# EasyEDA Pro project Gripper Project File.epro

# Board PCB2_2
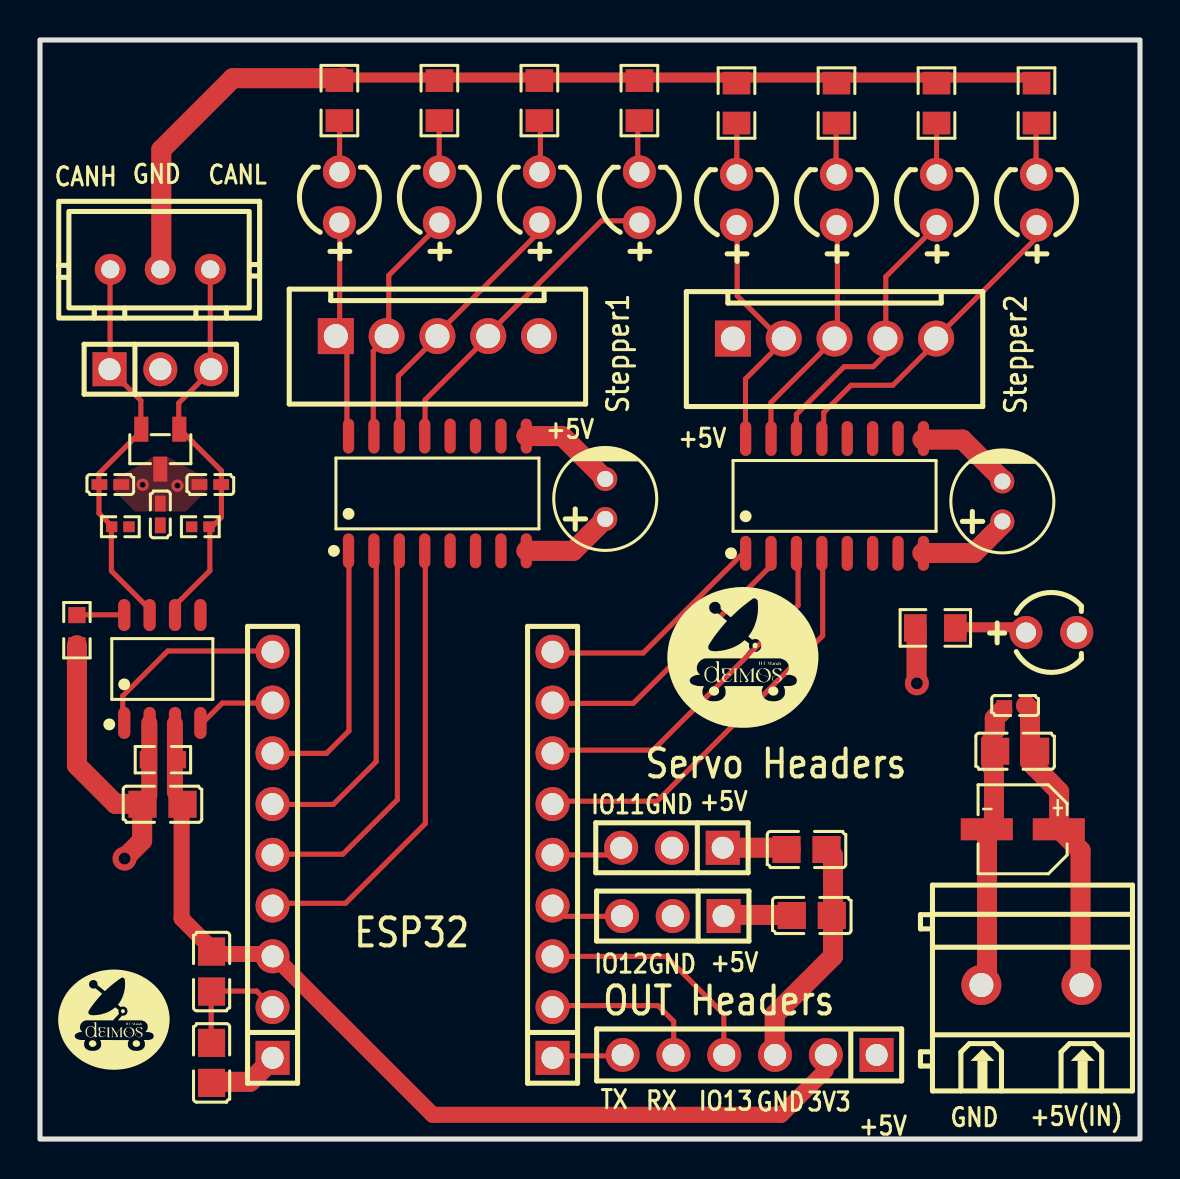
[diagram p0: board, top side]
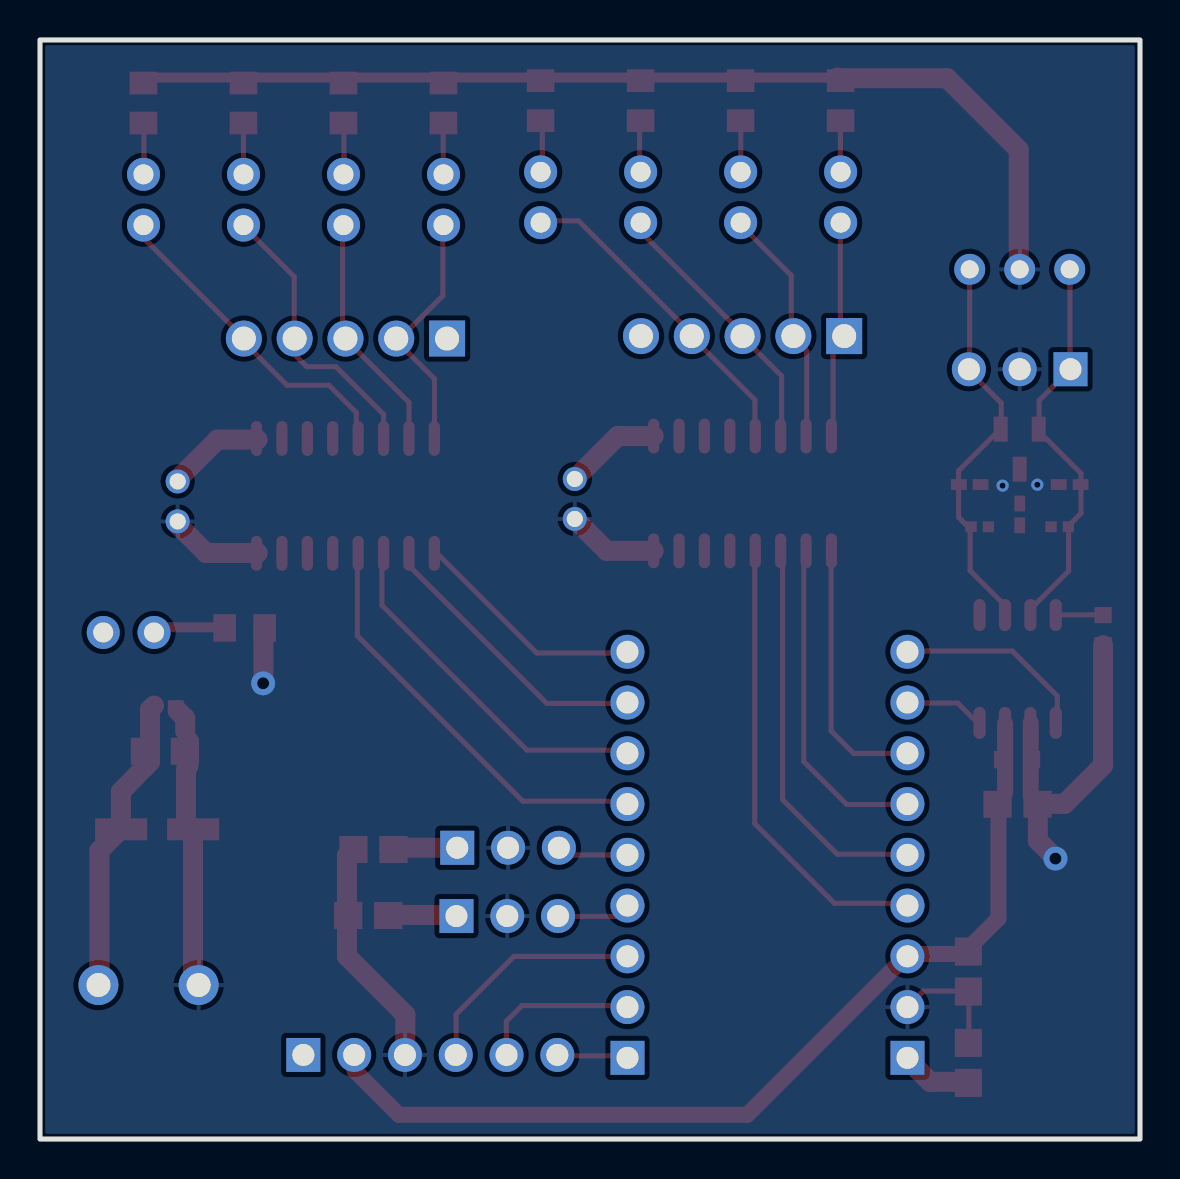
[diagram p1: board, bottom side, seen from below]

Outline 55 x 55 mm; copper layers: Top Layer, Inner1, Inner2, Bottom Layer. Coordinates in mm from the lower left corner of the outline.
Outline path: rectangle 0,55 55,0
Stack: Top Layer 0.035mm Outer layer thickness 1oz / Dielectric1 0.2104mm 7628 RC49% 8.6mil / Inner1 0.0152mm Inner layer thickness / Dielectric2 1.065mm 1.1mm H/HOZ Copper / Inner2 0.0152mm Inner layer thickness / Dielectric3 0.2104mm 7628 RC49% 8.6mil / Bottom Layer 0.035mm Outer layer thickness 1oz

## Design rules (mm)
template: Custom Config
spacing copperThickness1oz (default): track to track 0.102, other pairs 0.152 to 0.3
spacing copperThickness2oz: track to track 0.203, other pairs 0.152 to 0.3
track width copperThickness1oz (default): min 0.127, default 0.254, max 2.54
track width copperThickness2oz: min 0.203, default 0.254, max 2.54
differential pair differentialPair (default): width min 0.127, default 0.254, max 2.54; gap min 0.152, default 0.152
via viaSize (default): diameter min 0.5, default 0.61, max 10; hole min 0.3, default 0.305, max 6.3
net GND uses copperRegion1
net $1N8879 uses copperRegion1

## Placement (name value [footprint] x y rotation side)
C1  -  [C0402]  3.52 32.75 180 top
C2  4.7nF  [C0402]  6.02 31.26 270 top
C3  -  [C0402]  8.52 32.75 0 top
C4  10uF  [CAP-TH_BD5.0-P2.00-D0.6-FD]  28.26 32.03 90 top
C5  10uF  [CAP-TH_BD5.0-P2.00-D0.6-FD]  48.12 31.91 90 top
C6  CL21A226MQQNNNE  [C0805]  6.12 16.75 0 top
C7  CL05B104KP5NNNC  [R0603]  6.15 18.98 0 top
C8  1uF  [C0805]  48.76 19.41 0 top
C9  33nF  [C0402]  48.76 21.69 0 top
C10  1uF  [C0805]  38.33 14.49 0 top
C11  22uF  [CAP-SMD_BD4.0-L4.3-W4.3-LS5.1-FD]  49.14 15.5 180 top
C12  1uF  [C0805]  38.59 11.19 0 top
C13  1uF  [C0805]  8.58 8.38 90 top
C14  1uF  [C0805]  8.58 3.81 270 top
CN1  B5B-XH-A(LF)(SN)  [CONN-TH_B5B-XH-A-LF-SN]  19.87 40.18 180 top
CN2  B5B-XH-A(LF)(SN)  [CONN-TH_B5B-XH-A-LF-SN]  39.73 40.06 180 top
P1  Screw Terminal  [CONN-TH_2P-P5.00_WJ128V-5.0-2P]  49.57 7.71 0 top
R1  330Ω  [R0805]  14.97 51.97 90 top
R2  330Ω  [R0805]  19.97 51.97 90 top
R3  330Ω  [R0805]  24.97 51.97 90 top
R4  330Ω  [R0805]  29.97 51.97 90 top
R5  330Ω  [R0805]  34.83 51.84 90 top
R6  330Ω  [R0805]  39.83 51.84 90 top
R7  330Ω  [R0805]  44.83 51.84 90 top
R8  330Ω  [R0805]  49.83 51.84 90 top
R9  60.4kΩ  [R0402]  4.02 30.64 180 top
R10  60.4kΩ  [R0402]  8.02 30.64 0 top
R11  RC0603FR-1010KL  [R0603]  1.85 25.46 90 top
R12  330Ω  [R0805]  44.77 25.58 0 top
U1  LED  [LED-TH_BD4.0-P2.54-FD_RED]  14.97 47.13 90 top
U2  LED  [LED-TH_BD4.0-P2.54-FD_RED]  19.97 47.13 90 top
U3  LED  [LED-TH_BD4.0-P2.54-FD_RED]  24.97 47.13 90 top
U4  LED  [LED-TH_BD4.0-P2.54-FD_RED]  29.97 47.13 90 top
U5  LED  [LED-TH_BD4.0-P2.54-FD_RED]  34.83 47.01 90 top
U6  LED  [LED-TH_BD4.0-P2.54-FD_RED]  39.83 47.01 90 top
U7  LED  [LED-TH_BD4.0-P2.54-FD_RED]  44.83 47.01 90 top
U8  LED  [LED-TH_BD4.0-P2.54-FD_RED]  49.83 47.01 90 top
U9  B3B-XH-A(LF)(SN)  [CONN-TH_3P-P2.50_A2501WV2-3P]  6.02 43.52 180 top
U10  PZ254-1-03-Z-2.5-G1  [HDR-TH_3P-P2.54-V-M]  6.02 38.52 0 top
U11  ESD2CAN24DBZRQ1  [SOT-23-3_L2.9-W1.3-P1.90-LS2.4-BR]  6.02 34.52 90 top
U12  ULN2003A  [SOP-16_L10.0-W3.9-P1.27-LS6.0-BL]  19.87 32.31 0 top
U13  ULN2003A  [SOP-16_L10.0-W3.9-P1.27-LS6.0-BL]  39.73 32.18 0 top
U14  SN65HVD230DR  [SOIC-8_L4.9-W3.9-P1.27-LS6.0-BL-3]  6.12 23.52 0 top
U15  LED  [LED-TH_BD4.0-P2.54-FD_RED]  50.57 25.35 0 top
U16  PZ254-1-09-Z-2.5-G1  [HDR-TH_9P-P2.54-V-M]  11.63 14.22 90 top
U17  PZ254-1-09-Z-2.5-G1  [HDR-TH_9P-P2.54-V-M]  25.63 14.22 90 top
U18  PZ254-1-03-Z-2.5-G1  [HDR-TH_3P-P2.54-V-M]  31.6 14.58 180 top
U19  PZ254-1-03-Z-2.5-G1  [HDR-TH_3P-P2.54-V-M]  31.64 11.16 180 top
U20  PZ254-1-06-Z-2.5-G1  [HDR-TH_6P-P2.54-V-M]  35.48 4.21 180 top

## Footprints (pads in the part's own frame, mm; a bottom-side part is the same pattern mirrored in y, then rotated)
C0402
  rect 0.79x0.54 smd: 1(-0.545,0) 2(0.545,0)
C0805
  rect 1.41x1.35 smd: 1(-1,0) 2(1,0)
CAP-SMD_BD4.0-L4.3-W4.3-LS5.1-FD
  rect 2.6x1.1 smd: 1(-1.8,0) 2(1.8,0)
CAP-TH_BD5.0-P2.00-D0.6-FD
  round 1.202 hole 0.801: 1(-1,0) 2(1,0)
CONN-TH_2P-P5.00_WJ128V-5.0-2P
  round 2 hole 1.2: 1(-2.505,0) 2(2.505,0)
CONN-TH_3P-P2.50_A2501WV2-3P
  round 1.55 hole 0.9: 1(-2.5,0) 2(0,0) 3(2.5,0)
CONN-TH_B5B-XH-A-LF-SN
  rect 1.8x1.8 hole 1.2: 1(5.08,0)
  round 1.8 hole 1.2: 2(2.54,0) 3(0,0) 4(-2.54,0) 5(-5.08,0)
HDR-TH_3P-P2.54-V-M
  rect 1.7x1.7 hole 1.1: 1(-2.54,0)
  round 1.7 hole 1.1: 2(0,0) 3(2.54,0)
HDR-TH_6P-P2.54-V-M
  rect 1.7x1.7 hole 1.1: 1(-6.35,0)
  round 1.7 hole 1.1: 2(-3.81,0) 3(-1.27,0) 4(1.27,0) 5(3.81,0) 6(6.35,0)
HDR-TH_9P-P2.54-V-M
  rect 1.7x1.7 hole 1.1: 1(-10.16,0)
  round 1.7 hole 1.1: 2(-7.62,0) 3(-5.08,0) 4(-2.54,0) 5(0,0) 6(2.54,0) 7(5.08,0) 8(7.62,0) 9(10.16,0)
LED-TH_BD4.0-P2.54-FD_RED
  round 1.651 hole 1: 1(-1.27,0) 2(1.27,0)
R0402
  rect 0.566x0.54 smd: 1(-0.433,0) 2(0.433,0)
R0603
  rect 0.806x0.864 smd: 1(-0.753,0) 2(0.753,0)
R0805
  rect 1.133x1.377 smd: 1(-1,0) 2(1,0)
SOIC-8_L4.9-W3.9-P1.27-LS6.0-BL-3
  oval 0.61x1.6 smd: 1(-1.905,-2.7) 2(-0.635,-2.7) 3(0.635,-2.7) 4(1.905,-2.7) 5(1.905,2.7) 6(0.635,2.7) 7(-0.635,2.7) 8(-1.905,2.7)
SOP-16_L10.0-W3.9-P1.27-LS6.0-BL
  oval 0.56x1.745 smd: 1(-4.445,-2.873) 2(-3.175,-2.873) 3(-1.905,-2.873) 4(-0.635,-2.873) 5(0.635,-2.873) 6(1.905,-2.873) 7(3.175,-2.873) 8(4.445,-2.873) 9(4.445,2.873) 10(3.175,2.873) 11(1.905,2.873) 12(0.635,2.873) 13(-0.635,2.873) 14(-1.905,2.873) 15(-3.175,2.873) 16(-4.445,2.873)
SOT-23-3_L2.9-W1.3-P1.90-LS2.4-BR
  rect 1.25x0.7 smd: 1(1,-0.95) 2(1,0.95) 3(-1,0)

## Nets
3V3: C6.2 C7.2 C13.2 U14.3 U16.3 U20.2
+5V: C4.2 C5.2 C8.2 C9.2 C10.1 C11.1 C12.1 C14.2 CN1.5 CN2.1 P1.2 U12.9 U13.9 U15.2 U16.1 U18.1 U19.1 U20.1
GND: C1.1 C2.1 C3.1 C4.1 C5.1 C6.1 C7.1 C8.1 C9.1 C10.2 C11.2 C12.2 C13.1 C14.1 P1.1 R1.2 R2.2 R3.2 R4.2 R5.2 R6.2 R7.2 R8.2 R11.1 R12.1 U9.2 U10.2 U11.3 U12.8 U13.8 U14.2 U16.2 U18.2 U19.2 U20.3
CAN_N: C3.2 R10.2 U9.1 U10.3 U11.1 U14.6
CAN_P: C1.2 R9.2 U9.3 U10.1 U11.2 U14.7
GPIO1: U12.4 U16.4
GPIO2: U12.3 U16.5
GPIO3: U12.2 U16.6
GPIO4: U12.1 U16.7
GPIO5: U14.4 U16.8
GPIO6: U14.1 U16.9
GPIO7: U13.1 U17.9
GPIO8: U13.2 U17.8
GPIO9: U13.3 U17.7
GPIO10: U13.4 U17.6
GPIO11: U17.5 U18.3
GPIO12: U17.4 U19.3
GPIO13: U17.3 U20.4
RX: U17.2 U20.5
TX: U17.1 U20.6
$1N3261: R1.1 U1.2
$1N3266: CN1.1 U1.1 U12.16
$1N3511: R2.1 U2.2
$1N3516: CN1.2 U2.1 U12.15
$1N3549: R3.1 U3.2
$1N3554: CN1.3 U3.1 U12.14
$1N3587: R4.1 U4.2
$1N3592: CN1.4 U4.1 U12.13
$1N4638: R11.2 U14.8
$1N6402: R12.2 U15.1
$1N8879: C2.2 R9.1 R10.1
$1N14403: R5.1 U5.2
$1N14404: CN2.2 U5.1 U13.16
$1N14405: R6.1 U6.2
$1N14406: CN2.3 U6.1 U13.15
$1N14407: R7.1 U7.2
$1N14408: CN2.4 U7.1 U13.14
$1N14409: R8.1 U8.2
$1N14410: CN2.5 U8.1 U13.13

Pads without a net: U12 5 6 7 10 11 12; U13 5 6 7 10 11 12; U14 5

## Via types
v1: diameter 1.2, hole 0.6, Top Layer to Bottom Layer, 2 vias
v2: diameter 0.61, hole 0.305, Top Layer to Bottom Layer, 2 vias

## Routing (per net, layer and track width the routed paths; a pad name or vN(x,y) marks a point on that pad's centre or on a via; arc(x,y) is an arc through that point)
3V3: length 47.1
  Top Layer w0.8: 8.79,9.29 8.82,9.26 11.55,9.26 ; 39.27,4.08 39.27,3.43 37.05,1.21 19.64,1.21 11.6,9.25 ; 7.08,16.97 7.08,11.03 8.75,9.36 ; 6.74,20.79 6.74,17.34
+5V: length 35.5
  Top Layer w0.254: 24.96,40.19 24.95,40.17 24.95,40.04
  Top Layer w1: 34.18,11.21 37.57,11.21 ; 34.22,14.58 37.47,14.58 37.54,14.51 ; U12.9 26.11,35.18 C4.2 ; 50.97,15.49 52.03,14.44 52.03,7.72 ; C9.2 49.5,21.49 49.5,18.88 49.7,18.67 ; 8.52,2.86 10.5,2.86 11.66,4.02 ; 50.95,15.49 50.95,17.38 49.7,18.67 ; 49.83,18.55 49.7,18.67 ; 48.14,32.98 46.12,35 44.12,35
GND: length 110.5
  Top Layer w0.254: 8.6,7.4 8.63,7.43 ; 8.6,7.4 10.83,7.4 11.54,6.69 ; 8.6,7.4 8.56,7.36 8.56,4.9
  Top Layer w0.5: 15.13,53.12 49.78,53.12
  Top Layer w0.8: 5.04,16.77 5.03,16.76 ; 5.47,20.83 5.47,17.2
  Top Layer w1: 39.34,14.5 39.65,14.18 39.65,9.15 36.73,6.23 36.73,4.13 36.75,4.11 ; 47.58,19.96 47.58,18.65 ; R11.1 1.85,18.7 3.77,16.77 5.04,16.77 ; 4.21,14.04 5.11,14.93 5.11,16.65 ; 47.01,7.76 47.35,8.1 47.35,15.54 ; 6.07,43.51 6.07,49.51 9.64,53.09 15.1,53.09 15.13,53.12 ; 44.12,29.33 46.69,29.33 48.21,30.84 ; U12.8 26.67,29.43 C4.1 ; 47.32,15.58 47.27,15.53 ; 48.12,21.44 47.74,21.06 47.74,20.42 ; 43.83,25.61 43.83,22.87 ; 47.7,18.52 47.7,15.96
  vias: v1(4.23,14.04) v1(43.84,22.81) v2(5.13,32.74) v2(6.87,32.7)
CAN_N: length 19.3
  Top Layer w0.254: 8.49,30.62 8.49,28.44 6.74,26.68 ; 6.98,35.53 9.07,33.44 9.07,31.11 ; 8.52,43.51 8.52,38.55 ; 8.52,30.56 8.93,30.97 8.93,30.99 9.05,31.11 ; 6.94,35.53 6.94,36.83 8.59,38.48
CAN_P: length 19.3
  Top Layer w0.254: 3.5,38.5 5.04,36.95 5.04,35.58 ; 5.12,35.47 2.95,33.31 2.95,32.75 ; 2.95,32.75 2.95,32.71 ; 2.95,32.75 2.95,31.31 3.57,30.69 ; 3.47,38.5 3.48,38.52 ; 3.57,30.55 3.57,28.43 5.43,26.56 ; 3.5,43.55 3.5,38.54
GPIO1: length 23.2
  Top Layer w0.254: 19.27,29.53 19.27,15.79 15.28,11.8 11.59,11.8 11.53,11.73
GPIO2: length 20
  Top Layer w0.254: 17.87,29.46 17.87,16.98 15.14,14.25 11.7,14.25 11.56,14.39
GPIO3: length 16.4
  Top Layer w0.254: 11.73,16.78 11.76,16.74 14.66,16.74 16.81,18.89 16.81,29.29
GPIO4: length 13.4
  Top Layer w0.254: 15.45,29.6 15.45,20.42 14.32,19.3 11.7,19.3
GPIO5: length 3.9
  Top Layer w0.254: 8.1,20.8 9.11,21.82 11.58,21.82
GPIO6: length 9.8
  Top Layer w0.254: 4.14,20.85 4.14,22.17 6.39,24.42 11.64,24.42
GPIO7: length 11.8
  Top Layer w0.254: 25.57,24.32 30.16,24.32 35.25,29.41
GPIO8: length 14.4
  Top Layer w0.254: 25.61,21.8 29.66,21.8 36.57,28.71 36.57,29.3 36.59,29.32
GPIO9: length 17.9
  Top Layer w0.254: 37.9,29.35 37.9,26.71 30.65,19.46 25.61,19.46
GPIO10: length 20.9
  Top Layer w0.254: 39.13,29.38 39.13,25.18 30.86,16.91 25.99,16.91 25.92,16.98
GPIO11: length 3.5
  Top Layer w0.254: 25.64,14.22 28.69,14.22 29.02,14.55
GPIO12: length 3.6
  Top Layer w0.254: 29.09,11.15 26.27,11.15 25.7,11.71
GPIO13: length 11.8
  Top Layer w0.254: 25.65,9.14 31.3,9.14 34.19,6.25 34.19,4.22
RX: length 7.9
  Top Layer w0.254: 31.64,4.27 31.69,4.31 31.69,5.89 30.9,6.68 25.71,6.68
TX: length 3.5
  Top Layer w0.254: 25.65,4.16 29.06,4.16 29.09,4.19
$1N3261: length 2.6
  Top Layer w0.254: 14.98,50.98 14.98,48.37 14.96,48.35
$1N3266: length 11.1
  Top Layer w0.254: 14.98,45.98 14.98,40.39 14.78,40.19 ; 15.34,35.22 15.34,39.6 14.77,40.17
$1N3511: length 2.6
  Top Layer w0.254: 19.96,50.95 19.96,48.4 19.97,48.39
$1N3516: length 11.7
  Top Layer w0.254: 20.03,45.81 17.44,43.22 17.44,40.36 ; 16.66,35.31 16.66,39.43 17.38,40.14
$1N3549: length 2.6
  Top Layer w0.254: 25,48.31 25.02,48.34 25.02,50.88
$1N3554: length 13.8
  Top Layer w0.254: 19.79,40.22 25.04,45.47 25.04,45.88 ; 17.92,35.05 17.92,38.19 19.89,40.16
$1N3587: length 2.6
  Top Layer w0.254: 29.89,50.91 29.89,48.32
$1N3592: length 16.4
  Top Layer w0.254: 19.25,35.13 19.25,36.99 22.41,40.14 ; 22.28,40.15 28.08,45.95 29.98,45.95
$1N4638: length 2.4
  Top Layer w0.254: 1.76,26.25 1.78,26.23 4.16,26.23
$1N6402: length 3.6
  Top Layer w0.5: 45.81,25.61 49,25.61 49.31,25.29
$1N14403: length 2.6
  Top Layer w0.254: 34.87,48.25 34.84,48.27 34.84,50.89
$1N14404: length 12.4
  Top Layer w0.254: 34.86,45.85 34.86,42.2 37.14,39.92 ; 37.09,39.86 35.28,38.04 35.28,35.13
$1N14405: length 2.6
  Top Layer w0.254: 39.8,48.27 39.8,50.83 39.82,50.84
$1N14406: length 11.8
  Top Layer w0.254: 36.55,35.15 36.55,36.86 39.69,39.99 ; 39.87,45.85 39.87,40.39 39.73,40.26
$1N14407: length 2.6
  Top Layer w0.254: 44.83,48.28 44.83,50.85 44.8,50.88
$1N14408: length 14.4
  Top Layer w0.254: 42.19,40.2 42.19,39.17 41.66,38.65 40.21,38.65 37.82,36.27 37.82,35.15 ; 42.29,40.05 42.29,43.16 44.85,45.71
$1N14409: length 2.6
  Top Layer w0.254: 49.75,48.28 49.81,48.34 49.81,50.9
$1N14410: length 16.3
  Top Layer w0.254: 44.91,40.08 44.91,39.99 42.64,37.72 40.55,37.72 39.19,36.36 39.19,35.2 ; 44.74,40.02 49.82,45.1 49.82,45.75

## Copper pours and planes (outline as drawn; the poured copper is in the pictures)
+5V on Inner1: 0.05,55.05 55.14,55.05 55.14,-0.07 0.05,-0.07
+5V on Inner2: -0.03,55.14 55.05,55.14 55.05,-0.03 -0.03,-0.03
GND on Top Layer: 5.66,34.15 5.64,34.15 5.07,33.77 3.67,33.02 3.67,32.48 3.66,32.48 4.74,31.4 7.29,31.4 8.38,32.49 8.38,33.03 7.76,33.38 6.37,34.15
GND on Bottom Layer: -0.03,55.09 55.12,55.09 55.12,0.01 -0.03,0.01

## Text on the board
Top Silkscreen Layer: CANH | GND | CANL | IO11 | IO12 | TX | RX | IO13 | +5V | 3V3 | +5V(IN) | Stepper1 | Stepper2 | ESP32 | OUT Headers | Servo Headers
